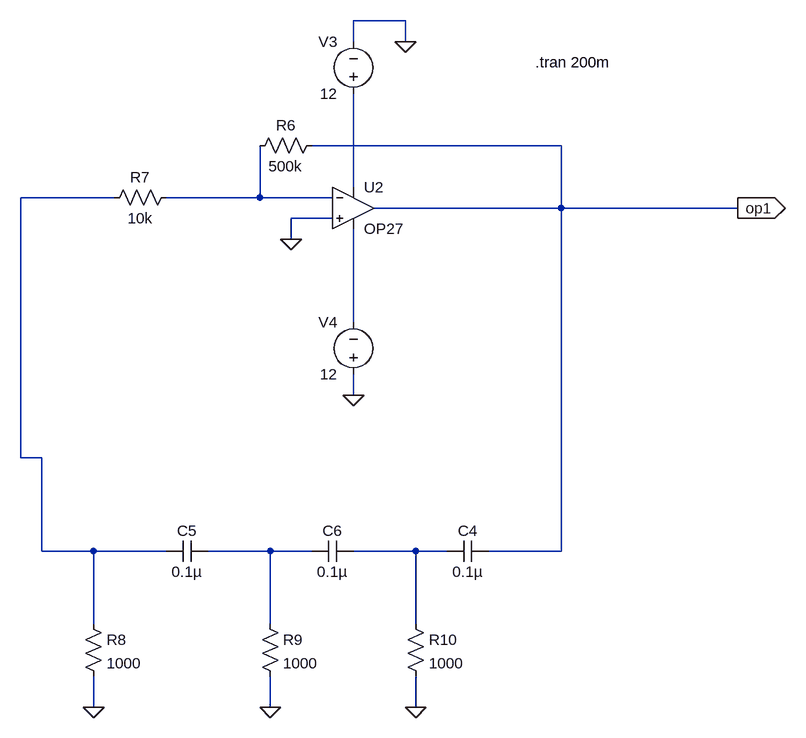
[diagram p0: schematic RC_phase_shift_oscillator_1.asc]
RC_phase_shift_oscillator_1.asc, the LTspice schematic file:
Version 4.1
SHEET 1 1656 2340
WIRE 288 784 208 784
WIRE 208 816 208 784
WIRE 288 816 288 784
WIRE 528 976 144 976
WIRE 208 1040 208 896
WIRE -160 1056 -304 1056
WIRE 64 1056 64 976
WIRE 64 1056 -80 1056
WIRE 176 1056 64 1056
WIRE 528 1072 528 976
WIRE 528 1072 240 1072
WIRE 800 1072 528 1072
WIRE 176 1088 112 1088
WIRE 112 1120 112 1088
WIRE 208 1248 208 1104
WIRE 208 1360 208 1328
WIRE -304 1456 -304 1056
WIRE -272 1456 -304 1456
WIRE -272 1600 -272 1456
WIRE -192 1600 -272 1600
WIRE -80 1600 -192 1600
WIRE 80 1600 -16 1600
WIRE 144 1600 80 1600
WIRE 304 1600 208 1600
WIRE 352 1600 304 1600
WIRE 528 1600 528 1072
WIRE 528 1600 416 1600
WIRE -192 1712 -192 1600
WIRE 80 1712 80 1600
WIRE 304 1712 304 1600
WIRE -192 1840 -192 1792
WIRE 80 1840 80 1792
WIRE 304 1840 304 1792
FLAG 112 1120 0
FLAG 208 1360 0
FLAG -192 1840 0
FLAG 80 1840 0
FLAG 304 1840 0
FLAG 288 816 0
FLAG 800 1072 op1
IOPIN 800 1072 Out
SYMBOL OpAmps\\OP27 208 1008 R0
SYMATTR InstName U2
SYMBOL voltage 208 912 R180
WINDOW 0 24 96 Left 2
WINDOW 3 24 16 Left 2
WINDOW 123 0 0 Left 0
WINDOW 39 0 0 Left 0
SYMATTR InstName V3
SYMATTR Value 12
SYMBOL voltage 208 1344 R180
WINDOW 0 24 96 Left 2
WINDOW 3 24 16 Left 2
WINDOW 123 0 0 Left 0
WINDOW 39 0 0 Left 0
SYMATTR InstName V4
SYMATTR Value 12
SYMBOL res 160 960 R90
WINDOW 0 0 56 VBottom 2
WINDOW 3 32 56 VTop 2
SYMATTR InstName R6
SYMATTR Value 500k
SYMBOL res -64 1040 R90
WINDOW 0 0 56 VBottom 2
WINDOW 3 32 56 VTop 2
SYMATTR InstName R7
SYMATTR Value 10k
SYMBOL cap 416 1584 R90
WINDOW 0 0 32 VBottom 2
WINDOW 3 32 32 VTop 2
SYMATTR InstName C4
SYMATTR Value 0.1µ
SYMBOL cap -16 1584 R90
WINDOW 0 0 32 VBottom 2
WINDOW 3 32 32 VTop 2
SYMATTR InstName C5
SYMATTR Value 0.1µ
SYMBOL cap 208 1584 R90
WINDOW 0 0 32 VBottom 2
WINDOW 3 32 32 VTop 2
SYMATTR InstName C6
SYMATTR Value 0.1µ
SYMBOL res -208 1696 R0
SYMATTR InstName R8
SYMATTR Value 1000
SYMBOL res 64 1696 R0
SYMATTR InstName R9
SYMATTR Value 1000
SYMBOL res 288 1696 R0
SYMATTR InstName R10
SYMATTR Value 1000
TEXT 488 848 Left 2 !.tran 200m

The netlist it stands for:
* RC_phase_shift_oscillator_1.asc
X§U2 0 N003 N001 N004 op1 OP27  ; pins In+ In- V+ V- OUT
V3 N001 0 12
V4 0 N004 12
R6 op1 N003 500k
R7 N003 N002 10k
C4 op1 N006 0.1µ
C5 N005 N002 0.1µ
C6 N006 N005 0.1µ
R8 N002 0 1000
R9 N005 0 1000
R10 N006 0 1000
.tran 200m
.lib ADI.lib
.backanno
.end